# EAGLE schematic Tangga (EAGLE 7.6.0)
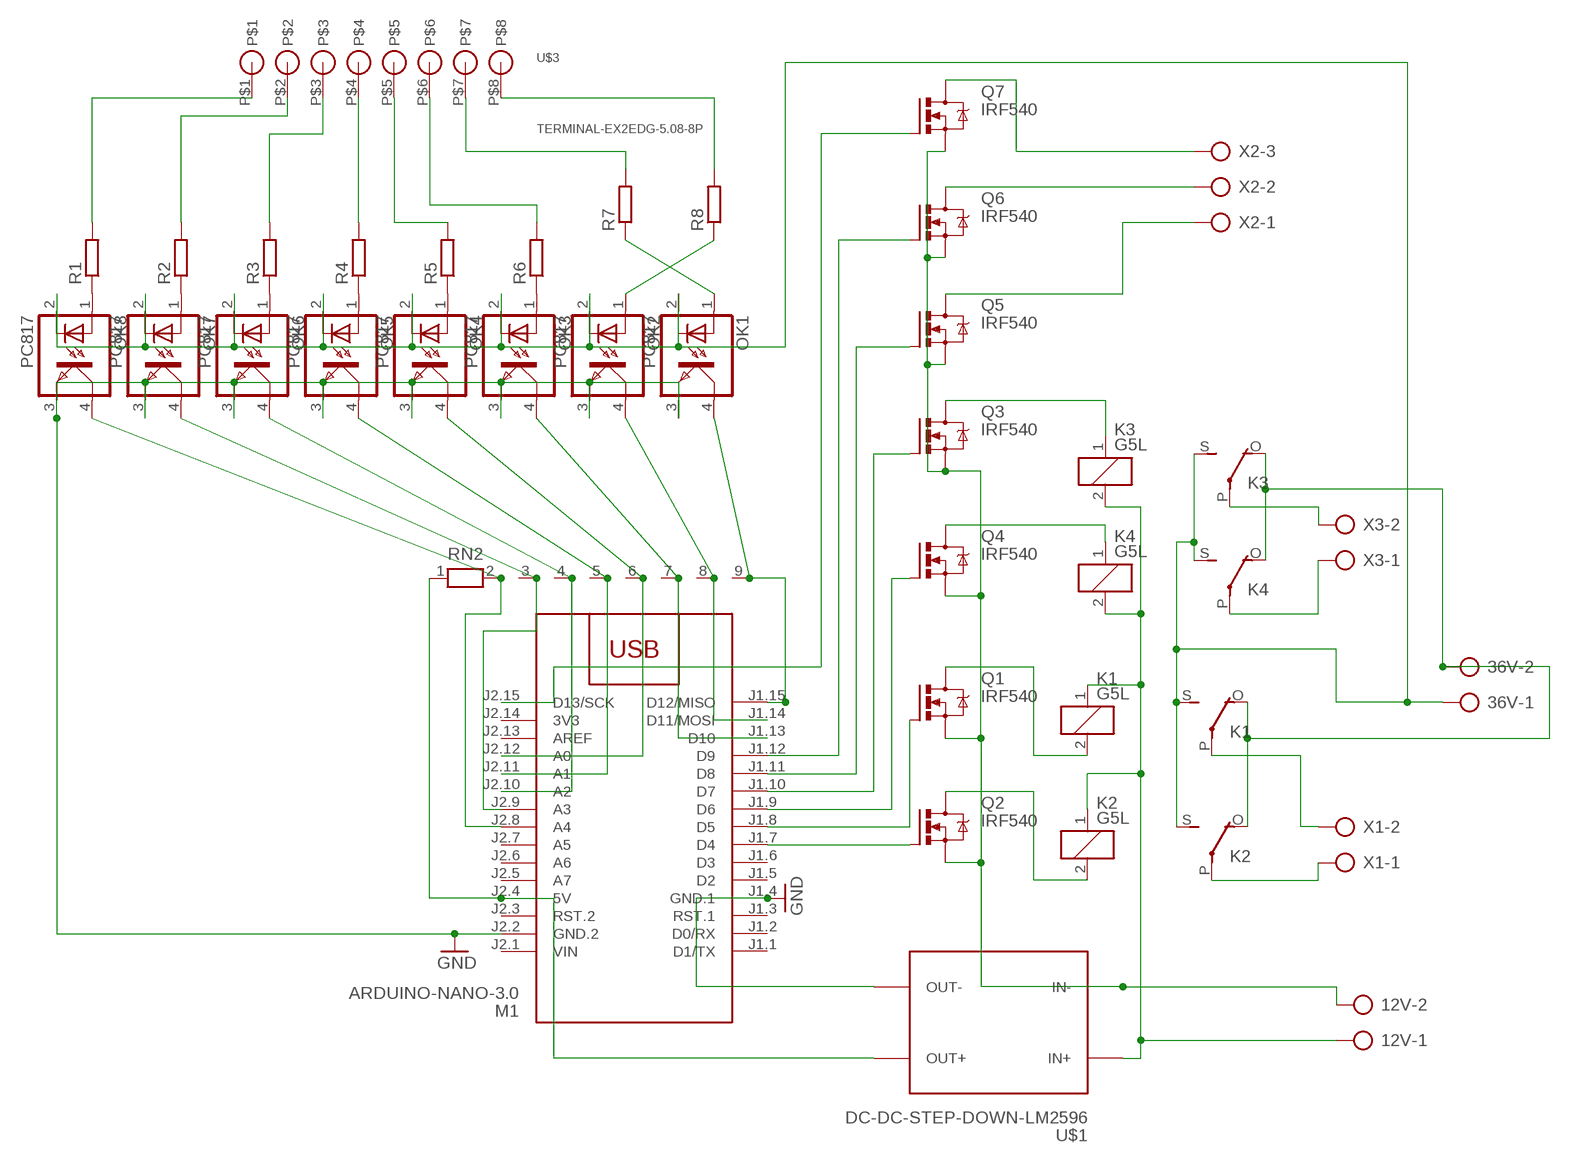
[diagram p0: schematic, sheet 1]

## Parts
12V  AK300/2  [AK300/2]
36V  AK300/2  [AK300/2]
K1  G5L  [G5LE]
K2  G5L  [G5LE]
K3  G5L  [G5LE]
K4  G5L  [G5LE]
M1  ARDUINO-NANO-3.0  [ARDUINO-NANO-3.0]
OK1  PC817  [DIL04]
OK2  PC817  [DIL04]
OK3  PC817  [DIL04]
OK4  PC817  [DIL04]
OK5  PC817  [DIL04]
OK6  PC817  [DIL04]
OK7  PC817  [DIL04]
OK8  PC817  [DIL04]
Q1  IRF540  [TO220BV]
Q2  IRF540  [TO220BV]
Q3  IRF540  [TO220BV]
Q4  IRF540  [TO220BV]
Q5  IRF540  [TO220BV]
Q6  IRF540  [TO220BV]
Q7  IRF540  [TO220BV]
R1  R-EU_0204/7  [0204/7]
R2  R-EU_0204/7  [0204/7]
R3  R-EU_0204/7  [0204/7]
R4  R-EU_0204/7  [0204/7]
R5  R-EU_0204/7  [0204/7]
R6  R-EU_0204/7  [0204/7]
R7  R-EU_0204/7  [0204/7]
R8  R-EU_0204/7  [0204/7]
RN2  RN08  [RN-9]
U$1  DC-DC-STEP-DOWN-LM2596  [DC-DC-STEP-DOWN-LM2596]
U$3  TERMINAL-EX2EDG-5.08-8P  [8P]
X1  AK300/2  [AK300/2]
X2  AK300/3  [AK300/3]
X3  AK300/2  [AK300/2]

## Nets
+36V: 36V.2 K1.O(2:O) K2.O(2:O) K3.O(2:O) K4.O(2:O)
-36V: 36V.1 K1.S(2:S) K2.S(2:S) K3.S(2:S) K4.S(2:S) OK1.2(C) OK2.2(C) OK3.2(C) OK4.2(C) OK5.2(C) OK6.2(C) OK7.2(C) OK8.2(C)
GND: M1.J1.4(GND.1) M1.J2.2(GND.2) OK1.3(EMIT) OK2.3(EMIT) OK3.3(EMIT) OK4.3(EMIT) OK5.3(EMIT) OK6.3(EMIT) OK7.3(EMIT) OK8.3(EMIT) U$1.OUT-
GND12: 12V.2 Q1.S Q2.S Q3.S Q4.S Q5.S Q6.S Q7.S U$1.IN-
N$1: Q7.D X2.3
N$2: M1.J1.15(D12/MISO) OK1.4(COL) RN2.9
N$3: K2.2 Q2.D
N$4: K1.2 Q1.D
N$5: M1.J2.15(D13/SCK) Q7.G
N$6: M1.J2.4(5V) RN2.1 U$1.OUT+
N$8: M1.J1.7(D4) Q2.G
N$9: 12V.1 K1.1 K2.1 K3.2 K4.2 U$1.IN+
N$10: M1.J1.8(D5) Q1.G
N$11: K2.P(2:P) X1.1
N$12: K1.P(2:P) X1.2
N$13: Q5.D X2.1
N$14: OK2.1(A) R8.1
N$15: K3.P(2:P) X3.2
N$16: K4.P(2:P) X3.1
N$17: Q6.D X2.2
N$18: K3.1 Q3.D
N$19: K4.1 Q4.D
N$20: M1.J1.9(D6) Q4.G
N$21: M1.J1.10(D7) Q3.G
N$22: M1.J2.8(A4) OK8.4(COL) RN2.2
N$23: OK1.1(A) R7.1
N$24: M1.J1.11(D8) Q5.G
N$25: M1.J1.12(D9) Q6.G
N$26: M1.J2.10(A2) OK6.4(COL) RN2.4
N$27: M1.J2.11(A1) OK5.4(COL) RN2.5
N$28: M1.J2.12(A0) OK4.4(COL) RN2.6
N$29: M1.J2.9(A3) OK7.4(COL) RN2.3
N$33: OK8.1(A) R1.1
N$34: OK7.1(A) R2.1
N$35: OK6.1(A) R3.1
N$36: OK5.1(A) R4.1
N$37: OK4.1(A) R5.1
N$38: OK3.1(A) R6.1
N$42: R1.2 U$3.P$1
N$43: R2.2 U$3.P$2
N$44: R3.2 U$3.P$3
N$45: R4.2 U$3.P$4
N$46: R5.2 U$3.P$5
N$47: R6.2 U$3.P$6
N$48: R7.2 U$3.P$7
N$49: R8.2 U$3.P$8
N$52: M1.J1.13(D10) OK3.4(COL) RN2.7
N$53: M1.J1.14(D11/MOSI) OK2.4(COL) RN2.8
Unconnected: M1.J1.1(D1/TX) M1.J1.2(D0/RX) M1.J1.3(RST.1) M1.J1.5(D2) M1.J1.6(D3) M1.J2.3(RST.2) M1.J2.5(A7) M1.J2.6(A6) M1.J2.7(A5) M1.J2.13(AREF)

## Power pins joined to a net without a drawn wire
3V3: M1.J2.14(3V3)
VIN: M1.J2.1(VIN)

## Library data of the parts
12V 36V X1 X3 = con-ptr500:AK300/2: CONNECTOR; OC_FARNELL: unknown; OC_NEWARK: unknown
K1-K4 = relay:G5L: RELAY 1 x switch, 10 A/120 V AC, 8 A/30 V ADC, Omron; OC_FARNELL: unknown; OC_NEWARK: unknown
M1 = diy-modules:ARDUINO-NANO-3.0: Arduino Nano 3.0 and compatible devices More details available here: https://www.arduino.cc/en/Main/ArduinoBoardNano Click here to find device on ebay.com <http://www.ebay.com/sch/arduino+nano>
OK1-OK8 = optocoupler:PC817: SHARP OPTO COUPLER; MPN: PC817X4J000F; OC_FARNELL: 9707727; OC_NEWARK: 97K7059
Q1-Q7 = transistor-power:IRF540: HEXFET Power MOSFET
R1-R8 = rcl:R-EU_: RESISTOR, European symbol
RN2 = resistor-net:RN08: RESISTOR NETWORK; OC_FARNELL: unknown; OC_NEWARK: unknown
U$1 = diy-modules:DC-DC-STEP-DOWN-LM2596: DC/DC Step-Down Regulator based on LM2596-ADJ chip LM2596 datasheet available here: http://www.ti.com/lit/ds/symlink/lm2596.pdf Click here to find device on ebay.com <http://www.ebay.com/sch/lm2596+power+regulator>
U$3 = Terminal-EX2EDG:TERMINAL-EX2EDG-5.08-8P
X2 = con-ptr500:AK300/3: CONNECTOR; OC_FARNELL: unknown; OC_NEWARK: unknown